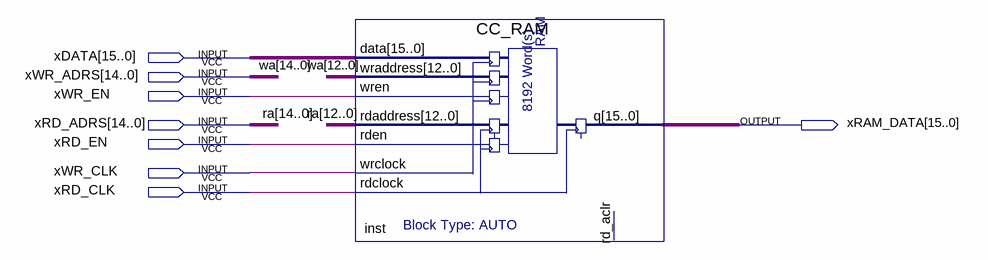
[diagram p0: schematic sheet]
// Quartus schematic CC_lvds_RAM.bdf as structural Verilog: 1 symbols, 8 pins
module CC_lvds_RAM (
  input  [15:0] xDATA,
  input  [14:0] xWR_ADRS,
  input  xWR_EN,
  input  [14:0] xRD_ADRS,
  input  xRD_EN,
  input  xWR_CLK,
  input  xRD_CLK,
  output [15:0] xRAM_DATA
);

  CC_RAM inst (
    .data(xDATA), .wraddress(xWR_ADRS[12:0]), .wren(xWR_EN), .rdaddress(xRD_ADRS[12:0]), .rden(xRD_EN),
    .wrclock(xWR_CLK), .rdclock(xRD_CLK), .q(xRAM_DATA));  // open: rd_aclr

  // Other names for the same wires on the sheet: ra[14:0] = xRD_ADRS; wa[14:0] = xWR_ADRS
endmodule
